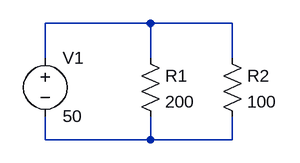
[diagram p0: schematic 2paraller.asc]
2paraller.asc, the LTspice schematic file:
Version 4
SHEET 1 880 680
WIRE 224 80 80 80
WIRE 336 80 224 80
WIRE 80 128 80 80
WIRE 224 128 224 80
WIRE 336 128 336 80
WIRE 80 240 80 208
WIRE 224 240 224 208
WIRE 224 240 80 240
WIRE 336 240 336 208
WIRE 336 240 224 240
SYMBOL voltage 80 112 R0
SYMATTR InstName V1
SYMATTR Value 50
SYMBOL res 208 112 R0
SYMATTR InstName R1
SYMATTR Value 200
SYMBOL res 320 112 R0
SYMATTR InstName R2
SYMATTR Value 100

The netlist it stands for:
* 2paraller.asc
V1 N001 N002 50
R1 N001 N002 200
R2 N001 N002 100
.backanno
.end